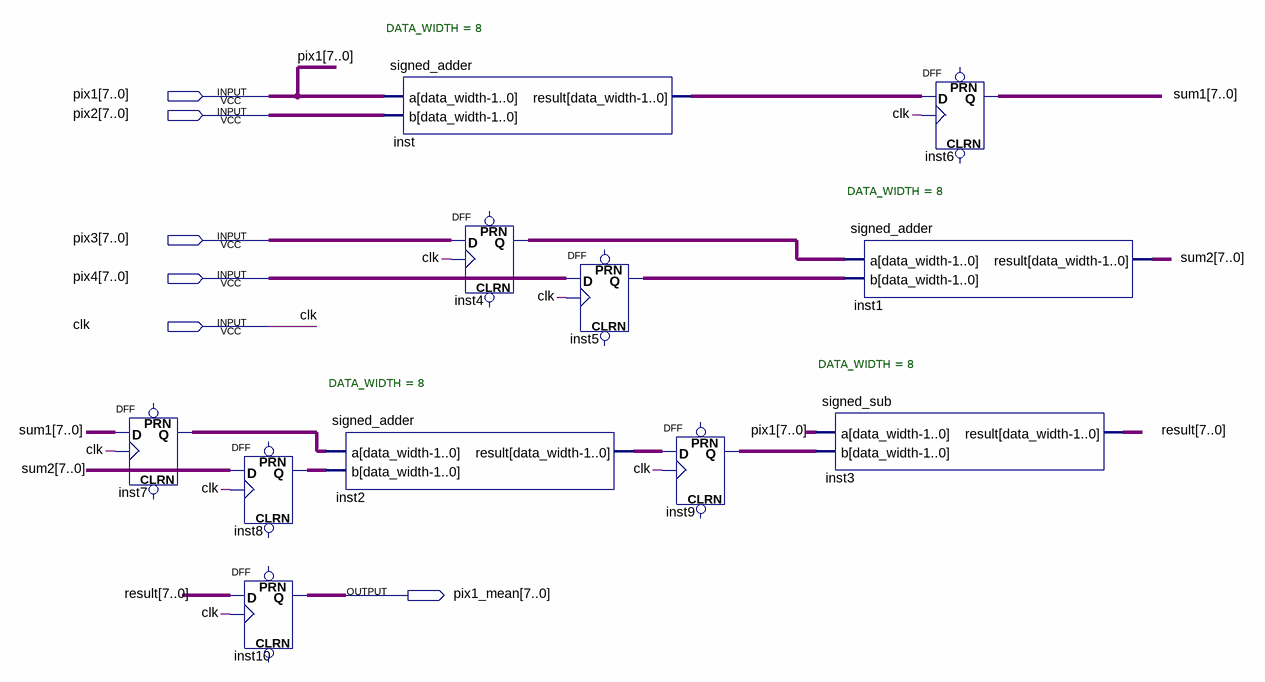
[diagram p0: schematic sheet]
// Quartus schematic simple_1.bdf as structural Verilog: 11 symbols, 6 pins
module simple_1 (
  input  [7:0] pix1,
  input  [7:0] pix2,
  input  [7:0] pix3,
  input  [7:0] pix4,
  input  clk,
  output [7:0] pix1_mean
);

  wire [7:0] inst2_result, inst4_q, inst5_q, inst7_q, inst8_q, inst9_q, inst_result, result, sum1, sum2;

  DFF inst7[7:0] (.CLK(clk), .D(sum1), .Q(inst7_q));  // open: CLRN, PRN
  DFF inst8[7:0] (.CLK(clk), .D(sum2), .Q(inst8_q));  // open: CLRN, PRN
  DFF inst10[7:0] (.CLK(clk), .D(result), .Q(pix1_mean));  // open: CLRN, PRN
  signed_adder #(.DATA_WIDTH(8)) inst2 (.a(inst7_q), .b(inst8_q), .result(inst2_result));
  signed_adder #(.DATA_WIDTH(8)) inst (.a(pix1), .b(pix2), .result(inst_result));
  DFF inst4[7:0] (.CLK(clk), .D(pix3), .Q(inst4_q));  // open: CLRN, PRN
  DFF inst5[7:0] (.CLK(clk), .D(pix4), .Q(inst5_q));  // open: CLRN, PRN
  DFF inst9[7:0] (.CLK(clk), .D(inst2_result), .Q(inst9_q));  // open: CLRN, PRN
  signed_adder #(.DATA_WIDTH(8)) inst1 (.a(inst4_q), .b(inst5_q), .result(sum2));
  signed_sub #(.DATA_WIDTH(8)) inst3 (.a(pix1), .b(inst9_q), .result(result));
  DFF inst6[7:0] (.CLK(clk), .D(inst_result), .Q(sum1));  // open: CLRN, PRN
endmodule
